# EAGLE design LT3652-MPPT (EAGLE 7.7.0)
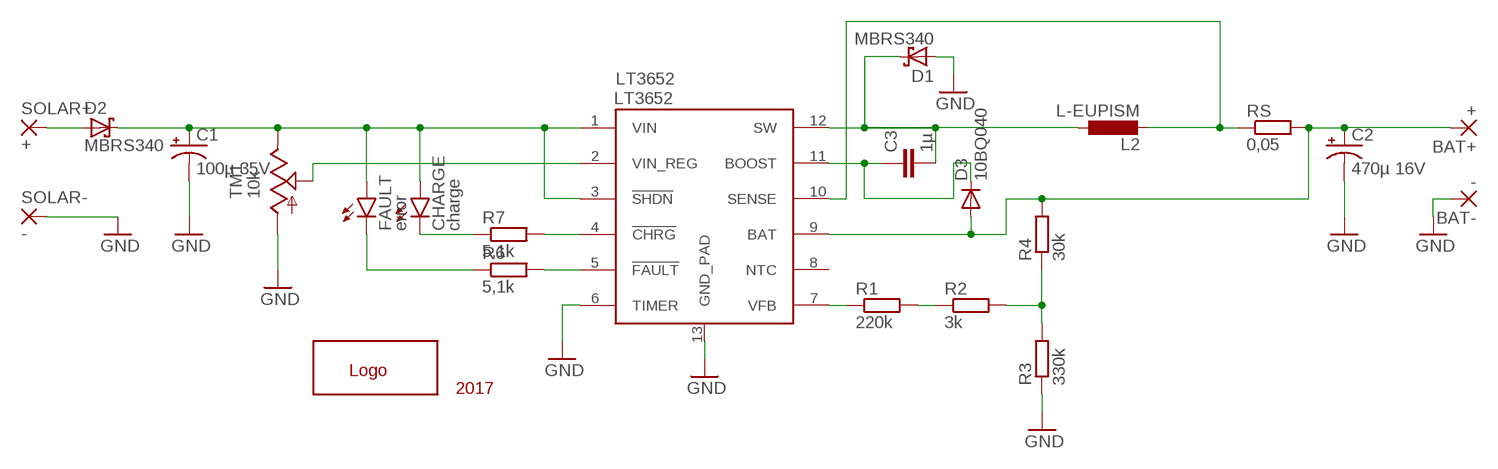
[diagram p0: schematic, sheet 1]

## Parts
BAT+  +  3,81/1,4  [3,81/1,4]
BAT-  -  3,81/1,4  [3,81/1,4]
C1  100µ 35V  CAP_POLC  [PANASONIC_C]
C2  470µ 16V  CAP_POLC  [PANASONIC_C]
C3  1µ  C-EUC0805  [C0805]
CHARGE  charge  LED-BLUE1206  [LED-1206]
D1  MBRS340  SCHOTTKY-DIODESMC  [SMC]
D2  MBRS340  SCHOTTKY-DIODESMC  [SMC]
D3  10BQ040  DIODESMA  [SMA-DIODE]
FAULT  error  LED-RED1206  [LED-1206]
L2  L-EUPISM  [PISM]
LT3652  LT3652  [MSOP-12_GND]
R1  220k  R-EU_R0805  [R0805]
R2  3k  R-EU_R0805  [R0805]
R3  330k  R-EU_R0805  [R0805]
R4  30k  R-EU_R0805  [R0805]
R6  5,1k  R-EU_R0805  [R0805]
R7  5,1k  R-EU_R0805  [R0805]
RS  0,05  R-EU_R1206  [R1206]
SOLAR+  +  3,81/1,4  [3,81/1,4]
SOLAR-  -  3,81/1,4  [3,81/1,4]
TM1  10k  TRIM5MMP  [5MMP]
U$1  2017  LOGO1  [LOGO]

## Nets
223K: R1.2 R2.1
BAT: BAT+.1(P) C2.+ D3.A LT3652.9(BAT) R4.2 RS.2
BOOST: C3.1 D3.C LT3652.11(BOOST)
CHRG: LT3652.4(!CHRG) R7.2
DIV: R2.2 R3.2 R4.1
FAULT: LT3652.5(!FAULT) R6.2
GND: BAT-.1(P) C1.- C2.- D1.A LT3652.6(TIMER) LT3652.13(GND_PAD) R3.1 SOLAR-.1(P) TM1.A
LEDBLUE: CHARGE.C R7.1
LEDRED: FAULT.C R6.1
N$2: D2.A SOLAR+.1(P)
SENSE: L2.2 LT3652.10(SENSE) RS.1
SW: C3.2 D1.C L2.1 LT3652.12(SW)
VFB: LT3652.7(VFB) R1.1
VIN: C1.+ CHARGE.A D2.C FAULT.A LT3652.1(VIN) LT3652.3(!SHDN) TM1.E
VREG: LT3652.2(VIN_REG) TM1.S
Unconnected: LT3652.8(NTC)

## Library data of the parts
BAT+ BAT- SOLAR+ SOLAR- = wirepad:3,81/1,4: THROUGH-HOLE PAD
C1 C2 = SparkFun:CAP_POL: Capacitor Polarized These are standard SMD and PTH capacitors. Normally 10uF, 47uF, and 100uF in electrolytic and tantalum varieties. Always verify the external diameter of the through hole cap, it varies with capacity, voltage, and manufacturer. The EIA devices should be standard.
C3 = rcl:C-EU: CAPACITOR, European symbol
CHARGE = DECADE-libraries20151104:LED-BLUE: Blue LEDs for production use Various blue LEDs stocked by SparkFun production 0603 - DIO-08575 Rebel - DIO-09553 1206 - DIO-09911; PROD_ID: DIO-09911; VALUE: BLUE
D1 D2 = diode:SCHOTTKY-DIODE: Schottky Diode
D3 = SparkFun:DIODE: Diode These are standard reverse protection diodes and small signal diodes. SMA package can handle up to about 1A. SOD-323 can handle about 200mA. What the SOD-323 package when ordering, there are some mfgs out there that are 5-pin packages.
FAULT = DECADE-libraries20151104:LED-RED: Assorted Red LEDs LilyPad 1206- DIO-09912 1206- DIO-00809 0603- DIO-00819; PROD_ID: DIO-00809; VALUE: RED
L2 = Inductor-Fastron:L-EU
LT3652 = SparkFun-IC-Power:LT3652: LT3652 MPPT Solar Charge Controller(IC-11822) 5V-32V smart charger for batteries up to 14.4V
R1-R4 R6 R7 RS = rcl:R-EU_: RESISTOR, European symbol
TM1 = BMIReflow:TRIM
U$1 = groovy:LOGO

## Board
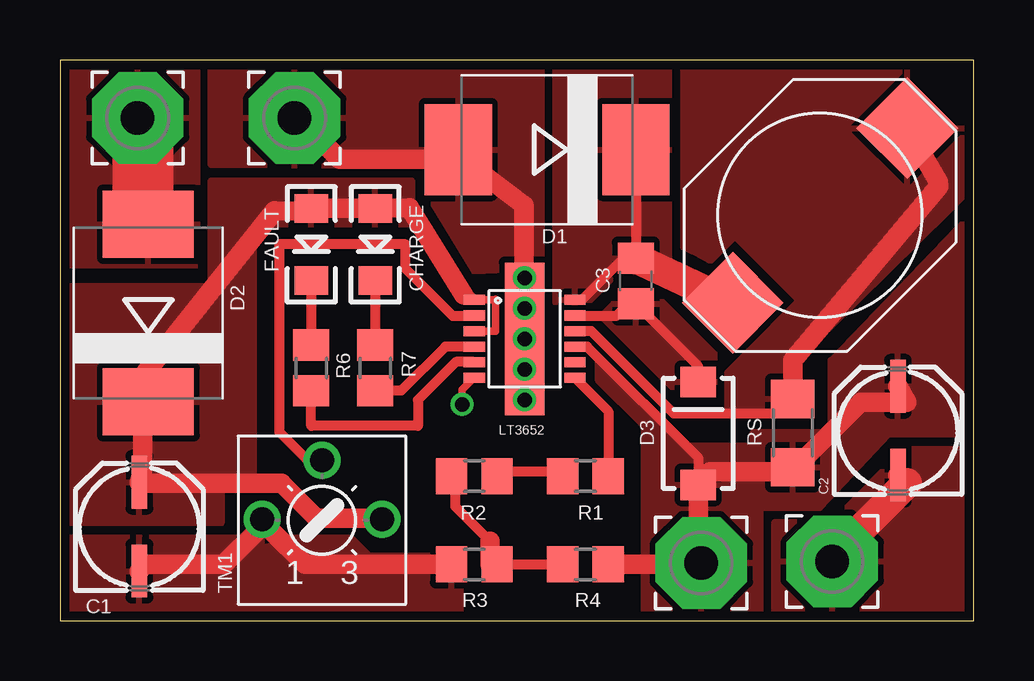
[diagram p1: board, top side]
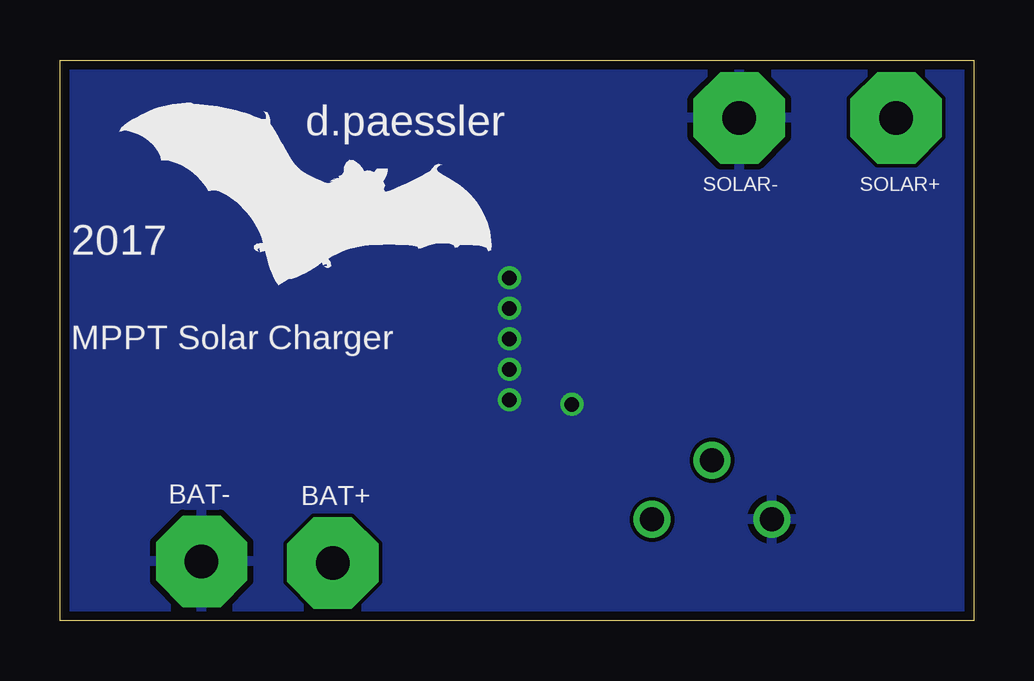
[diagram p2: board, bottom side, seen from below]

Size 38.1 x 23.37 mm. Coordinates in mm from the lower left corner, seen from the top.
Outline: 0,0 38.1,0 38.1,23.37 0,23.37 0,0
Copper layers (1*16): Top 0.0356mm / dielectric 1.5011mm / Bottom 0.0356mm
Design rules "LaenPCBOrder": minimum track width 6mil, minimum drill 13mil, track to track 6mil, track to pad 6mil, pad to pad 6mil, via to via 6mil, smd to smd 6mil, copper to edge 15mil, drill to drill 6mil, minimum pad ring 7mil, minimum via ring 7mil, stop-mask expansion 3mil, vias tented up to drill 0mil, thermal gap 10mil

### Footprints (pad centres in the part's own frame; a part is rotated, then mirrored left to right if it is on the bottom)
3,81/1,4 = drill 1.397 pad 3.81 octagon: 1 0,0
PANASONIC_C = smd 2.2 x 0.65: + 1.9,-0.2; - -1.8,-0.2
C0805 = smd 1.3 x 1.5: 1 -0.95,0; 2 0.95,0
LED-1206 = smd 1.2 x 1.4: A -1.5,0; C 1.5,0
SMC = smd 2.8 x 3.8: A 3.7,0; C -3.7,0
SMA-DIODE = smd 1.27 x 1.47: A -2.15,0; C 2.15,0
PISM = smd 3 x 3: 1 -5.15,0; 2 5.15,0
MSOP-12_GND = smd 0.889 x 0.42: 1 -2.1,1.625; 2 -2.1,0.975; 3 -2.1,0.325; 4 -2.1,-0.325; 5 -2.1,-0.975; 6 -2.1,-1.625; 7 2.1,-1.625; 8 2.1,-0.975; 9 2.1,-0.325; 10 2.1,0.325; 11 2.1,0.975; 12 2.1,1.625 | smd 1.651 x 6.35: 13 0,0
R0805 = smd 1.3 x 1.5: 1 -0.95,0; 2 0.95,0
R1206 = smd 1.6 x 1.803: 1 -1.422,0; 2 1.422,0
5MMP = drill 1 pad 1.55: A -2.5,0.04; E 2.5,0.04; S 0,2.5

### Placement (x,y rotation side)
BAT+  26.73,2.41 0 top
BAT-  32.19,2.48 0 top
C1  3.11,3.87 90 top
C2  34.73,7.87 90 top
C3  24,14.16 90 top
CHARGE  13.14,15.68 270 top
D1  20.31,19.63 180 top
D2  3.68,12.83 90 top
D3  26.61,7.81 90 top
FAULT  10.48,15.68 270 top
L2  31.69,16.89 45 top
LT3652  19.37,11.75 0 top
R1  21.91,6.03 180 top
R2  17.27,6.03 180 top
R3  17.27,2.35 0 top
R4  21.91,2.35 0 top
R6  10.48,10.54 270 top
R7  13.14,10.54 270 top
RS  30.54,7.82 270 top
SOLAR+  3.24,20.95 0 top
SOLAR-  9.78,20.95 0 top
TM1  10.92,4.19 0 top
U$1  27.88,17.78 0 bottom

### Tracks (layer width: path | path; a pad name or v marks a point on that pad's centre or on a via)
223K
  Top 0.406: 20.83,6.21 18.41,6.21
  Top 0.813: 18.41,6.21 R2.1 | 20.83,6.21 R1.2
BAT
  Top 0.406: LT3652.9 21.97,11.43 26.61,6.79 D3.A
  Top 0.813: 26.62,2.35 26.62,5.25 D3.A 26.62,5.73 27.1,6.21 30.48,6.21 RS.2 30.96,6.69 33.38,9.11 35.31,9.11 C2.+ | 26.62,2.35 R4.2 | 26.62,2.35 BAT+.1
  pour Top: 29.21,0.19 29.21,7.3 26.1,7.3 22.42,10.99 22.42,10.03 24.32,8.13 24.32,0.19
  pour Top: 38.35,17.34 38.35,7.75 34.54,7.75 31.69,4.7 28.89,4.7 28.89,7.87 32.07,7.87 32.07,7.94 32.13,7.94 32.13,10.86
BOOST
  Top 0.406: LT3652.11 21.49,12.7 23.18,12.7 23.69,13.21 C3.1 26.61,10.61 D3.C
  pour Top: 22.54,12.7 25.78,9.46 27.3,9.46 27.3,11.11 24.7,13.72 23.56,13.72
CHRG
  Top 0.406: LT3652.4 16.07,11.43 14.23,9.59 R7.2
DIV
  Top 0.406: 16.48,5.73 16.48,4.76 17.93,3.31 | R3.2 R4.1
  Top 0.813: 17.93,3.31 17.93,2.35 R3.2 | 16.48,5.73 R2.2
FAULT
  Top 0.406: LT3652.5 17.25,10.79 16.51,10.79 14.92,9.21 14.92,8.13 10.48,8.13 R6.2
GND  (via drill 0.6, 0.6 pad 0.25)
  Top 0.305: LT3652.6 16.76,9.62 v16.76,9.02 | v19.37,9.21 v19.37,10.48
  Top 0.813: R3.1 10.21,2.35 8.76,3.8 TM1.A 8.28,3.8 6.83,2.35 3.45,2.35 C1.- | 35.31,5.73 C2.- | 31.93,2.35 BAT-.1 | SOLAR-.1 10.21,20.69 11.66,19.24 16.97,19.24 D1.A 17.45,18.76 19.34,17.31 19.34,12 LT3652.13
  Top 1.27: 31.93,2.35 35.31,5.73
  other vias: 19.37,11.75 19.37,14.29 19.37,13.02
  pour Bottom: -0.89,-0.06 38.73,-0.06 38.67,23.81 -0.89,23.88
  pour Top: -0.44,3.49 12.13,3.49 12.89,2.73 16.7,2.73 16.7,0.06 -0.44,0.06
  pour Top: 6.29,23.43 20.07,23.37 20.07,14.67 17.27,14.54 15.24,17.91 15.18,17.91 15.18,18.92 6.29,18.99
  pour Top: 29.78,0.38 29.78,4.13 32.19,4.13 35.18,7.18 38.35,7.18 38.35,0.38
LEDBLUE
  Top 0.406: CHARGE.C R7.1
LEDRED
  Top 0.406: FAULT.C R6.1
N$2
  Top 0.813: 3.45,16.83 D2.A | 3.45,20.69 SOLAR+.1
  Top 2.54: 3.45,20.69 3.45,16.83
  pour Top: 5.71,23.5 5.71,14.8 -0.38,14.8 -0.38,23.43
SENSE
  Top 0.406: RS.1 29.93,8.64 25.59,8.64 22.15,12.07 LT3652.10
  Top 0.813: RS.1 30.54,10.86 36.64,18.1 36.62,18.29 L2.2
  pour Top: 25.97,23.43 25.97,15.56 26.54,15.3 27.11,14.99 28.13,16 32,12.13 38.29,18.29 38.29,23.5 26.04,23.5 26.04,23.43
  pour Top: 27.81,8.64 27.81,10.35 31.62,14.16 32.58,13.21 30.29,10.92 30.29,8.64
SW
  Top 0.406: D1.C C3.2 23.94,15.05 23.43,15.05 21.75,13.37 LT3652.12 | 27.39,13.53 L2.1
  Top 1.27: C3.2 27.39,13.53
  pour Top: 20.64,23.3 20.64,13.27 22.03,13.27 23.3,14.54 25.15,14.54 25.4,14.99 25.4,23.3
VFB
  Top 0.406: LT3652.7 22.86,8.73 R1.1
VIN
  Top 0.305: LT3652.3 18.16,12.06 18.16,13.4 18.14,13.37 LT3652.1
  Top 0.406: FAULT.A 10.5,17.21 10.54,17.21 10.4,17.07 | 16.83,13.59 16.85,13.82 LT3652.1
  Top 0.813: TM1.E 13.11,4.28 10.69,4.28 9.25,5.73 3.45,5.73 C1.+ 3.45,6.21 3.45,9.11 D2.C 2.97,9.59 8.94,17.08 10.4,17.07 | FAULT.A CHARGE.A 14.58,17.21 16.83,13.59
  pour Top: -0.38,13.97 6.29,13.97 6.29,18.35 14.67,18.35 14.67,16.51 8.06,16.51 8.06,5.91 6.73,5.91 6.73,4.06 -0.38,4.06
VREG
  Top 0.406: LT3652.2 17.25,12.7 16.38,12.7 14.41,14.67 14.41,15.68 9.14,15.68 9.14,7.87 10.33,6.69 TM1.S

### Text on the board
bPlace: MPPT Solar Charger